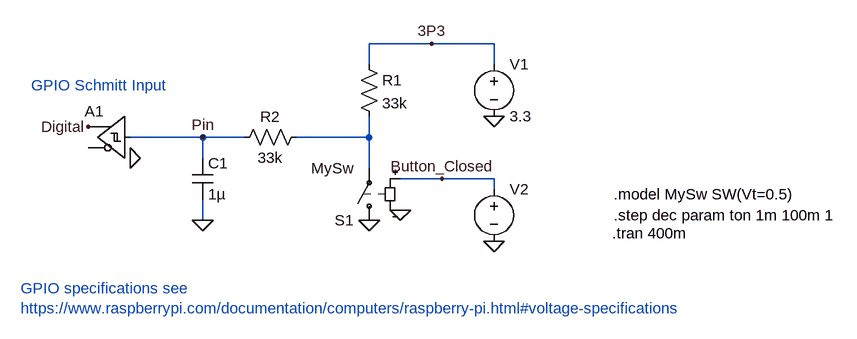
[diagram p0: schematic Debounce.asc]
Debounce.asc, the LTspice schematic file:
Version 4
SHEET 1 1164 680
WIRE 512 -32 416 -32
WIRE 608 -32 512 -32
WIRE 416 0 416 -32
WIRE 608 0 608 -32
WIRE 160 112 48 112
WIRE 224 112 160 112
WIRE 416 112 416 80
WIRE 416 112 304 112
WIRE 160 144 160 112
WIRE 416 160 416 112
WIRE 528 176 464 176
WIRE 608 176 528 176
WIRE 608 192 608 176
WIRE 160 240 160 208
FLAG 160 240 0
FLAG 464 224 0
FLAG 416 240 0
FLAG 608 272 0
FLAG 608 80 0
FLAG 160 112 Pin
FLAG 528 176 Button_Closed
FLAG 48 144 0
FLAG -16 96 Digital
FLAG 512 -32 3P3
SYMBOL cap 144 144 R0
SYMATTR InstName C1
SYMATTR Value 1µ
SYMBOL res 400 -16 R0
SYMATTR InstName R1
SYMATTR Value 33k
SYMBOL res 320 96 R90
WINDOW 0 0 56 VBottom 2
WINDOW 3 32 56 VTop 2
SYMATTR InstName R2
SYMATTR Value 33k
SYMBOL sw 416 256 R180
SYMATTR InstName S1
SYMATTR Value MySw
SYMBOL voltage 608 -16 R0
WINDOW 123 0 0 Left 0
WINDOW 39 0 0 Left 0
SYMATTR InstName V1
SYMATTR Value 3.3
SYMBOL voltage 608 176 R0
WINDOW 3 24 96 Invisible 2
WINDOW 123 0 0 Left 0
WINDOW 39 0 0 Left 0
SYMATTR InstName V2
SYMATTR Value PULSE(0 1 {ton} 1n 1n {ton})
SYMBOL Digital\\schmitt 48 48 M0
SYMATTR InstName A1
SYMATTR SpiceLine vt=1.3 vh=0.4
TEXT 792 200 Left 2 !.model MySw SW(Vt=0.5)
TEXT 792 232 Left 2 !.step dec param ton 1m 100m 1
TEXT 790 260 Left 2 !.tran 400m
TEXT -104 32 Left 2 ;GPIO Schmitt Input
TEXT -120 344 Left 2 ;GPIO specifications see\nhttps://www.raspberrypi.com/documentation/computers/raspberry-pi.html#voltage-specifications

The netlist it stands for:
* Debounce.asc
C1 Pin 0 1µ
R1 3P3 N001 33k
R2 N001 Pin 33k
S1 0 N001 Button_Closed 0 MySw
V1 3P3 0 3.3
V2 Button_Closed 0 PULSE(0 1 {ton} 1n 1n {ton})
A1 Pin 0 0 0 0 0 Digital 0 SCHMITT vt=1.3 vh=0.4
.model MySw SW(Vt=0.5)
.step dec param ton 1m 100m 1
.tran 400m
* GPIO Schmitt Input
* GPIO specifications see
* https://www.raspberrypi.com/documentation/computers/raspberry-pi.html#voltage-specifications
.backanno
.end